# EasyEDA schematic SCH_New-Project_2026-09-16.json
TITLE: Sheet_1; REV: 1.0; Date: 2023-04-25; Sheet: 1/1; Drawn By: tomtheswede; Company: Your Company
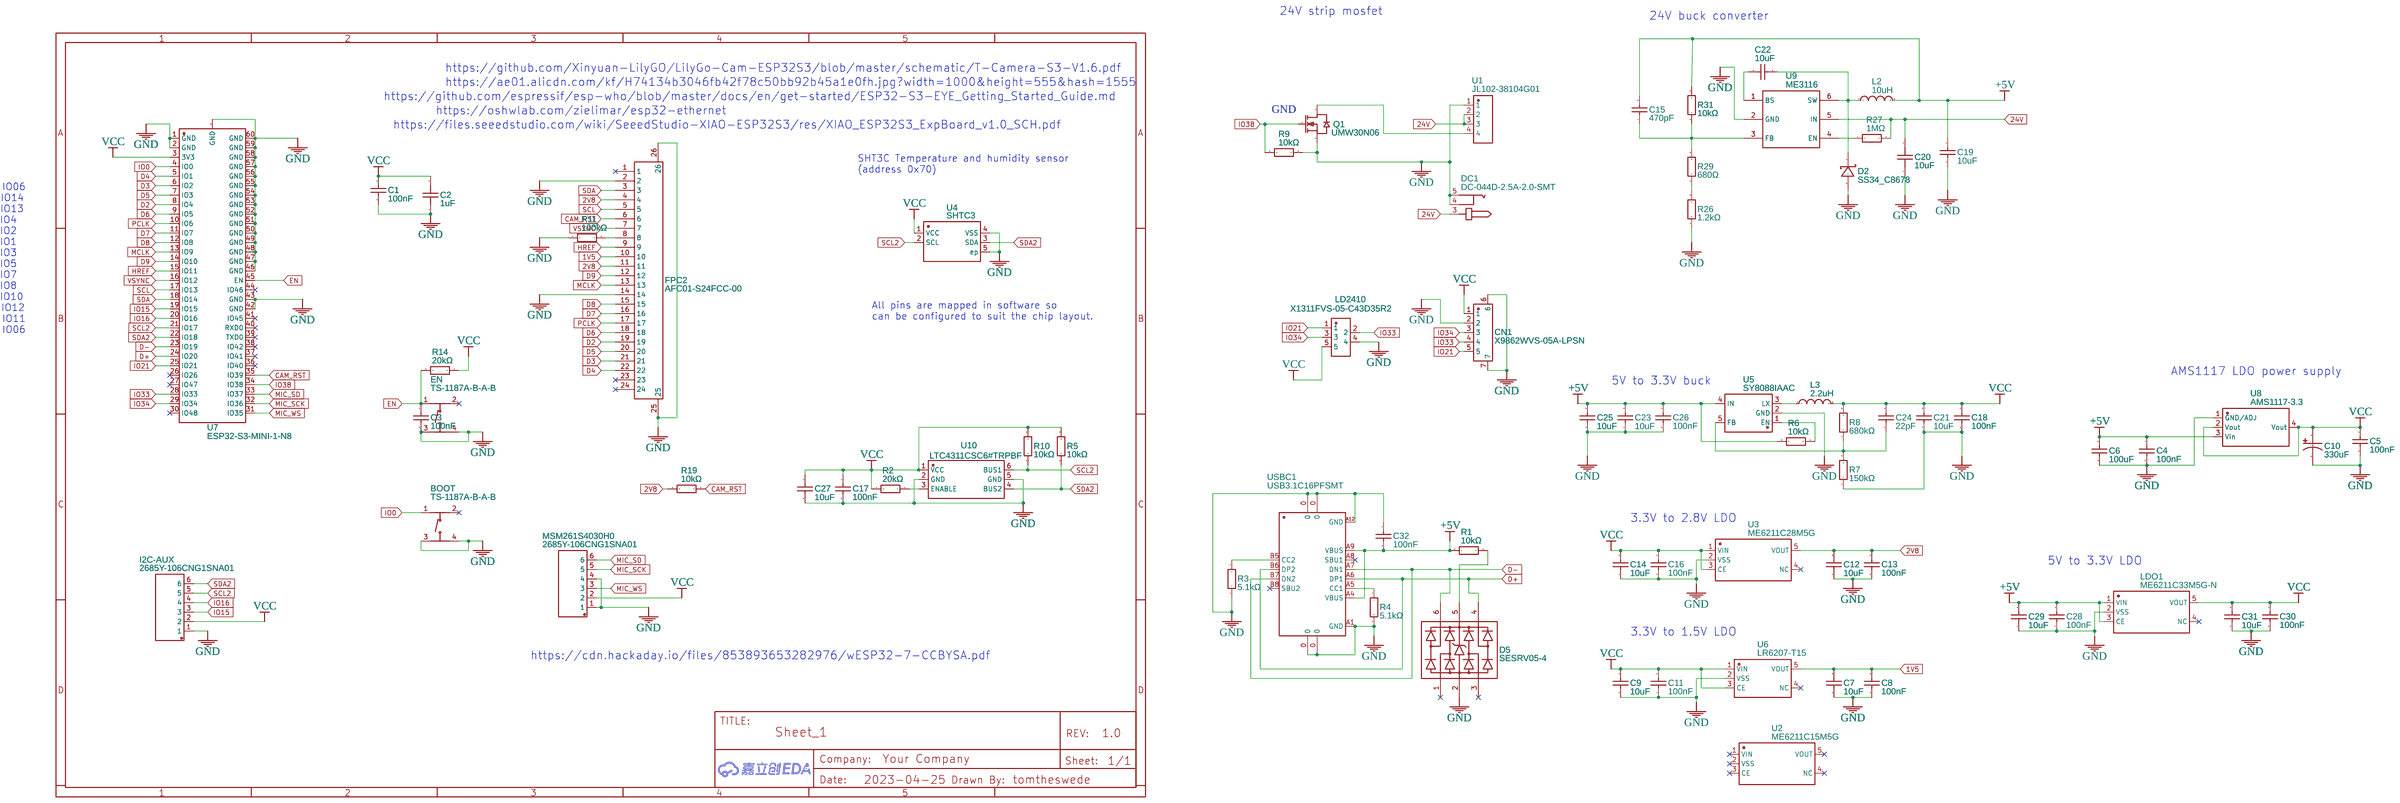
[diagram p0: schematic sheet]

## Parts
BOOT  TS-1187A-B-A-B  [SW-SMD_4P-L5.1-W5.1-P3.70-LS6.5-TL-2]
C1  100nF  [C0402]
C2  1uF  [C0402]
C3  100nF  [C0402]
C4  100nF  [C0402]
C5  100nF  [C0402]
C6  100uF  [C1206]
C7  10uF  [C0402]
C8  100nF  [C0402]
C9  10uF  [C0402]
C10  330uF  [CAP-SMD_L6.0-W3.2-R-RD]
C11  100nF  [C0402]
C12  10uF  [C0402]
C13  100nF  [C0402]
C14  10uF  [C0402]
C15  470pF  [C0402]
C16  100nF  [C0402]
C17  100nF  [C0402]
C18  100nF  [C0402]
C19  10uF  [C0805]
C20  10uF  [C0805]
C21  10uF  [C0402]
C22  10uF  [C0805]
C23  10uF  [C0402]
C24  22pF  [C0402]
C25  10uF  [C0402]
C26  100nF  [C0402]
C27  10uF  [C0402]
C28  100nF  [C0402]
C29  10uF  [C0402]
C30  100nF  [C0402]
C31  10uF  [C0402]
C32  100nF  [C0402]
CN1  X9862WVS-05A-LPSN  [CONN-SMD_X9862WVS-05A-LPSN]
D2  SS34_C8678  [SMA_L4.3-W2.6-LS5.2-RD]
D5  SESRV05-4  [SOT-23-6_L2.9-W1.6-P0.95-LS2.8-BR]
DC1  DC-044D-2.5A-2.0-SMT  [DC-IN-SMD_DC-044D-2.5A-2.0-SMT]
EN  TS-1187A-B-A-B  [SW-SMD_4P-L5.1-W5.1-P3.70-LS6.5-TL-2]
FPC2  AFC01-S24FCC-00  [FPC-SMD_P0.5-24P_FGS-XJ-H2.0]
I2C-AUX  2685Y-106CNG1SNA01  [HDR-TH_6P-P2.54-V-F]
L2  10uH  [IND-SMD_L5.8-W5.2]
L3  2.2uH  [IND-SMD_L4.0-W4.0_FNR40XXS]
LD2410  X1311FVS-05-C43D35R2  [CONN-SMD_5P-P1.27_XKB_X1311FVS-05-C43D35R2]
LDO1  ME6211C33M5G-N  [SOT-23-5_L3.0-W1.7-P0.95-LS2.8-BL]
MSM261S4030H0  2685Y-106CNG1SNA01  [HDR-TH_6P-P2.54-V-F]
Q1  UMW30N06  [TO-252-2_L6.6-W6.1-P4.57-LS9.9-BR-CW]
R1  10kΩ  [R0402]
R2  20kΩ  [R0402]
R3  5.1kΩ  [R0402]
R4  5.1kΩ  [R0402]
R5  10kΩ  [R0402]
R6  10kΩ  [R0402]
R7  150kΩ  [R0402]
R8  680kΩ  [R0603]
R9  10kΩ  [R0402]
R10  10kΩ  [R0402]
R11  100kΩ  [R0402]
R14  20kΩ  [R0402]
R19  10kΩ  [R0402]
R26  1.2kΩ  [R0402]
R27  1MΩ  [R0805]
R29  680Ω  [R0402]
R31  10kΩ  [R0402]
U1  JL102-38104G01  [CONN-TH_4P-P3.81_JILN_JL102-38104G01]
U2  ME6211C15M5G  [SOT-23-5_L3.0-W1.7-P0.95-LS2.8-BR]
U3  ME6211C28M5G  [SOT-23-5_L3.0-W1.7-P0.95-LS2.8-BR]
U4  SHTC3  [SENSORM-SMD_4P-L2.0-W2.0-P1.00]
U5  SY8088IAAC  [SOT-23-5_L3.0-W1.7-P0.95-LS2.8-BL]
U6  LR6207-T15  [SOT-23-5_L2.9-W1.6-P0.95-LS2.8-BL]
U7  ESP32-S3-MINI-1-N8  [BULETM-SMD_ESP32-S3-MINI-1-N8]
U8  AMS1117-3.3  [SOT-223-3_L6.5-W3.4-P2.30-LS7.0-BR]
U9  ME3116  [SOT-23-6_L2.9-W1.6-P0.95-LS2.8-BL]
U10  LTC4311CSC6#TRPBF  [SC-70-6_L2.1-W1.3-P0.65-LS2.1-BR]
USBC1  USB3.1C16PFSMT  [USB-C-SMD_TYPE-C-USB-17]

## Library data of the parts
BOOT EN = TS-1187A-B-A-B: Supplier: LCSC; Supplier Part: C318884; Manufacturer: XKB Enterprise; Contributor: LCSC; JLCPCB Part Class: Basic Part
C1 C3-C5 C8 C11 C13 C16-C18 C26 C28 C30 C32 = CL05B104KO5NNNC: Supplier: LCSC; Manufacturer: SAMSUNG(三星); Supplier Part: C1525; JLCPCB Part Class: Basic Part; link: https://lcsc.com/eda_search?q=C1525&%26type=1&ref=editor
C2 = CL05A105KA5NQNC: Supplier: LCSC; Manufacturer: SAMSUNG(三星); Supplier Part: C52923; JLCPCB Part Class: Basic Part; link: https://lcsc.com/eda_search?q=C52923&%26type=1&ref=editor
C6 = CL31A107MQHNNNE: Supplier: LCSC; Manufacturer: SAMSUNG; Supplier Part: C15008; JLCPCB Part Class: Basic Part
C7 C9 C12 C14 C21 C23 C25 C27 C29 C31 = CL05A106MQ5NUNC: Supplier: LCSC; Manufacturer: SAMSUNG; Supplier Part: C15525; JLCPCB Part Class: Basic Part
C10 = CA45-C6R3K337T: Supplier: LCSC; Supplier Part: C201144; Manufacturer: Hunan Xiangyee in S&T; Contributor: LCSC; JLCPCB Part Class: Extended Part
C15 = 0402B471K500NT: Supplier: LCSC; Manufacturer: FH(风华); Supplier Part: C1537; JLCPCB Part Class: Basic Part
C19 C22 = CL21A106KAYNNNE: Supplier: LCSC; Manufacturer: SAMSUNG(三星); Supplier Part: C15850; JLCPCB Part Class: Basic Part
C20 = GRM21BR61H106KE43L: Supplier: LCSC; Supplier Part: C440198; Manufacturer: muRata(村田); Contributor: LCSC; JLCPCB Part Class: Basic Part
C24 = 0402CG220J500NT: Supplier: LCSC; Manufacturer: FH(风华); Supplier Part: C1555; JLCPCB Part Class: Basic Part
CN1 = X9862WVS-05A-LPSN: Contributor: LCSC; Supplier: LCSC; Supplier Part: C696930; Manufacturer: XKB Connectivity(中国星坤); Manufacturer Part: X9862WVS-05A-6TSN; JLCPCB Part Class: Extended Part; link: https://lcsc.com/eda_search?q=C696930&%26type=1&ref=editor
D2 = SS34_C8678: Supplier: LCSC; Manufacturer Part: SS34; Manufacturer: MDD; Supplier Part: C8678; JLCPCB Part Class: Basic Part
D5 = SESRV05-4: Contributor: LCSC; Supplier: LCSC; Supplier Part: C294963; Manufacturer: SEMIWARE(赛米微尔); JLCPCB Part Class: Extended Part; link: https://lcsc.com/eda_search?q=C294963&%26type=1&ref=editor
DC1 = DC-044D-2.5A-2.0-SMT: Supplier: LCSC; Supplier Part: C397342; Manufacturer: XKB Connectivity(中国星坤); Contributor: LCSC; JLCPCB Part Class: Extended Part
FPC2 = AFC01-S24FCC-00: Supplier: LCSC; Supplier Part: C262276; Manufacturer: JS(钜硕电子); Contributor: LCSC; JLCPCB Part Class: Extended Part
I2C-AUX MSM261S4030H0 = 2685Y-106CNG1SNA01: Supplier: LCSC; Supplier Part: C350307; Manufacturer: 华宇创; Contributor: LCSC; JLCPCB Part Class: Extended Part
L2 = SM5845-100MT: Supplier: LCSC; Manufacturer: SXN(顺翔诺); Supplier Part: C9164; JLCPCB Part Class: Extended Part
L3 = FNR4030S2R2MT: Supplier: LCSC; Manufacturer: cjiang(长江微电); Contributor: LCSC; Supplier Part: C167869; JLCPCB Part Class: Extended Part
LD2410 = X1311FVS-05-C43D35R2: Supplier: LCSC; Supplier Part: C2881514; Manufacturer: XKB Connectivity(中国星坤); Contributor: LCSC; JLCPCB Part Class: Extended Part
LDO1 = ME6211C33M5G-N: Supplier: LCSC; Manufacturer: MICRONE(南京微盟); Supplier Part: C82942; JLCPCB Part Class: Extended Part; link: https://lcsc.com/eda_search?q=C82942&%26type=1&ref=editor
Q1 = UMW30N06: Supplier: LCSC; Supplier Part: C369599; Manufacturer: UMW(广东友台半导体); Manufacturer Part: 30N06; Contributor: LCSC; JLCPCB Part Class: Extended Part
R1 R5 R6 R9 R10 R19 R31 = 0402WGF1002TCE: Supplier: LCSC; Manufacturer: UniOhm; Supplier Part: C25744; Resistance (Ohms): 10K; JLCPCB Part Class: Basic Part
R2 R14 = 0402WGF2002TCE: Supplier: LCSC; Manufacturer: UNI-ROYAL(厚声); Supplier Part: C25765; Resistance (Ohms): 20K; JLCPCB Part Class: Basic Part
R3 R4 = 0402WGF5101TCE: Supplier: LCSC; Manufacturer: UniOhm; Supplier Part: C25905; Resistance (Ohms): 5.1K; JLCPCB Part Class: Basic Part
R7 = 0402WGF1503TCE: Supplier: LCSC; Manufacturer: UNI-ROYAL(厚声); Supplier Part: C25755; Resistance (Ohms): 150K; JLCPCB Part Class: Basic Part
R8 = 0603WAF6803T5E: Supplier: LCSC; Manufacturer: UNI-ROYAL(厚声); Supplier Part: C25822; Resistance (Ohms): 680K; JLCPCB Part Class: Basic Part
R11 = 0402WGF1003TCE: Supplier: LCSC; Manufacturer: UNI-ROYAL(厚声); Supplier Part: C25741; Resistance (Ohms): 100K; JLCPCB Part Class: Basic Part
R26 = 0402WGF1201TCE: Supplier: LCSC; Manufacturer: UNI-ROYAL(厚声); Supplier Part: C25862; Resistance (Ohms): 1.2K; JLCPCB Part Class: Basic Part
R27 = 0805W8F1004T5E: Supplier: LCSC; Manufacturer: UNI-ROYAL(厚声); Supplier Part: C17514; Resistance (Ohms): 1M; JLCPCB Part Class: Basic Part
R29 = 0402WGF6800TCE: Supplier: LCSC; Manufacturer: UNI-ROYAL(厚声); Supplier Part: C25130; Resistance (Ohms): 680; JLCPCB Part Class: Basic Part
U1 = JL102-38104G01: Contributor: LCSC; Supplier: LCSC; Supplier Part: C2917323; Manufacturer: JILN(锦凌); JLCPCB Part Class: Extended Part; link: https://lcsc.com/eda_search?q=C2917323&%26type=1&ref=editor
U2 = ME6211C15M5G: Supplier: LCSC; Manufacturer: MICRONE(南京微盟); Manufacturer Part: ME6211C15M5G-N; Supplier Part: C53100; JLCPCB Part Class: Extended Part
U3 = ME6211C28M5G: Supplier: LCSC; Manufacturer: MICRONE(南京微盟); Manufacturer Part: ME6211C28M5G-N; Supplier Part: C53099; JLCPCB Part Class: Extended Part
U4 = SHTC3: Supplier: LCSC; Supplier Part: C194656; Manufacturer: Sensirion; Contributor: LCSC; JLCPCB Part Class: Extended Part
U5 = SY8088IAAC: Supplier: LCSC; Supplier Part: C479072; Manufacturer: 矽力杰silergy; Contributor: LCSC; JLCPCB Part Class: Extended Part
U6 = LR6207-T15: Contributor: LCSC; Supplier: LCSC; Supplier Part: C459780; Manufacturer: LR(朗瑞); JLCPCB Part Class: Extended Part; link: https://lcsc.com/eda_search?q=C459780&%26type=1&ref=editor
U7 = ESP32-S3-MINI-1-N8: Supplier: LCSC; Supplier Part: C2913206; Manufacturer: ESPRESSIF(乐鑫); link: https://atta.szlcsc.com/upload/public/pdf/source/20220425/7F117D7A09F85946280540FD9EFDF9F3.pdf; JLCPCB Part Class: Extended Part; Contributor: lcsc
U8 = AMS1117-3.3: sourceId: dwIGgezVh; Supplier: LCSC; Manufacturer: AMS; Supplier Part: C6186; JLCPCB Part Class: Basic Part
U9 = ME3116: Supplier: LCSC; Manufacturer: MICRONE(南京微盟); Manufacturer Part: ME3116AM6G; Supplier Part: C97643; JLCPCB Part Class: Extended Part
U10 = LTC4311CSC6#TRPBF: Contributor: LCSC; Supplier: LCSC; Supplier Part: C580856; Manufacturer: ADI(亚德诺); JLCPCB Part Class: Extended Part; link: https://lcsc.com/eda_search?q=C580856&%26type=1&ref=editor
USBC1 = USB3.1C16PFSMT: Supplier: LCSC; Supplier Part: C167321; Manufacturer: LCSC; Contributor: LCSC; JLCPCB Part Class: Extended Part

## Nets
1V5: C7.2 C8.1 FPC2.10 U6.5(VOUT)
2V8: C12.2 C13.1 FPC2.4 FPC2.11 R19.1 U3.5(VOUT)
24V: C20.2 DC1.3 R27.2 U1.2 U1.3 U9.5(IN)
+5V: C4.1 C6.1 C15.2 C19.2 C23.2 C25.2 C26.1 C28.1 C29.2 C32.2 L2.2 LDO1.1(VIN) LDO1.3(CE) R1.2 R6.2 R31.2 U5.4(IN) U8.3(Vin) USBC1.A4(VBUS) USBC1.A9(VBUS)
GND: BOOT.3(C) BOOT.4(D) C1.2 C2.1 C3.2 C4.2 C5.2 C6.2 C7.1 C8.2 C9.1 C10.2 C11.2 C12.1 C13.2 C14.1 C16.2 C17.2 C18.2 C19.1 C20.1 C21.1 C23.1 C25.1 C26.2 C27.1 C28.2 C29.1 C30.2 C31.1 C32.1 CN1.2 CN1.6 CN1.7 D2.2(A) D5.2 DC1.4 DC1.5 EN.3(C) EN.4(D) FPC2.2 FPC2.14 FPC2.25 FPC2.26 I2C-AUX.1 LD2410.4 LDO1.2(VSS) MSM261S4030H0.1 MSM261S4030H0.4 Q1.3(S) R3.1 R4.2 R7.1 R9.2 R11.1 R26.1 U1.1 U3.2(VSS) U4.4(VSS) U4.5(ep) U5.2(GND) U6.2(VSS) U7.1(GND) U7.2(GND) U7.42(GND) U7.43(GND) U7.46(GND) U7.47(GND) U7.48(GND) U7.49(GND) U7.50(GND) U7.51(GND) U7.52(GND) U7.53(GND) U7.54(GND) U7.55(GND) U7.56(GND) U7.57(GND) U7.58(GND) U7.59(GND) U7.60(GND) U7.GND U8.1(GND/ADJ) U9.2(GND) U10.2(GND) U10.5(GND) USBC1.0 USBC1.A1(GND) USBC1.A12(GND)
VCC: C1.1 C2.2 C5.1 C9.2 C10.1 C11.1 C14.2 C16.1 C17.1 C18.1 C21.2 C24.2 C27.2 C30.1 C31.2 CN1.1 I2C-AUX.2 L3.2 LD2410.5 LDO1.5(VOUT) MSM261S4030H0.2 R2.2 R5.2 R8.2 R10.2 R14.1 U3.1(VIN) U3.3(CE) U4.1(VCC) U6.1(VIN) U6.3(CE) U7.3(3V3) U8.2(Vout) U8.4(Vout) U10.1(VCC)
CAM_RST: FPC2.6 R19.2 U7.35(IO39)
D2: FPC2.19 U7.8(IO4)
D3: FPC2.21 U7.6(IO2)
D4: FPC2.22 U7.5(IO1)
D5: FPC2.20 U7.7(IO3)
D6: FPC2.18 U7.9(IO5)
D7: FPC2.16 U7.11(IO7)
D8: FPC2.15 U7.12(IO8)
D9: FPC2.12 U7.14(IO10)
D+: D5.4 U7.24(IO20) USBC1.A6(DP1) USBC1.B6(DP2)
D-: D5.6 U7.23(IO19) USBC1.A7(DN1) USBC1.B7(DN2)
EN: C3.1 EN.1(A) R14.2 U7.45(EN)
HREF: FPC2.9 U7.15(IO11)
IO0: BOOT.1(A) U7.4(IO0)
IO15: I2C-AUX.3 U7.19(IO15)
IO16: I2C-AUX.4 U7.20(IO16)
IO21: CN1.5 LD2410.1 U7.25(IO21)
IO33: CN1.4 LD2410.2 U7.28(IO33)
IO34: CN1.3 LD2410.3 U7.29(IO34)
IO38: Q1.1(G) R9.1 U7.34(IO38)
MCLK: FPC2.13 U7.13(IO9)
MIC_SCK: MSM261S4030H0.5 U7.32(IO36)
MIC_SD: MSM261S4030H0.6 U7.33(IO37)
MIC_WS: MSM261S4030H0.3 U7.31(IO35)
PCLK: FPC2.17 U7.10(IO6)
SCL: FPC2.5 U7.17(IO13)
SCL2: I2C-AUX.5 R10.1 U4.2(SCL) U7.21(IO17) U10.6(BUS1)
SDA: FPC2.3 U7.18(IO14)
SDA2: I2C-AUX.6 R5.1 U4.3(SDA) U7.22(IO18) U10.4(BUS2)
VSYNC: FPC2.7 U7.16(IO12)
Net-(C15-1): C15.1 R29.2 R31.1 U9.3(FB)
Net-(C22-1): C22.1 D2.1(K) L2.1 U9.6(SW)
Net-(C22-2): C22.2 U9.1(BS)
Net-(C24-1): C24.1 R7.2 R8.1 U5.5(FB)
Net-(D5-5): D5.5 R1.1
Net-(FPC2-8): FPC2.8 R11.2
Net-(L3-1): L3.1 U5.3(LX)
Net-(Q1-2): Q1.2(D) U1.4
Net-(R2-1): R2.1 U10.3(ENABLE)
Net-(R3-2): R3.2 USBC1.B5(CC2)
Net-(R4-1): R4.1 USBC1.A5(CC1)
Net-(R6-1): R6.1 U5.1(EN)
Net-(R26-2): R26.2 R29.1
Net-(R27-1): R27.1 U9.4(EN)

Not connected (* = marked no-connect by the designer): BOOT 2(B)*; D5 1* 3*; EN 2(B)*; FPC2 1* 23* 24*; LDO1 4(NC)*; U2 1(VIN)* 2(VSS)* 3(CE)* 4(NC)* 5(VOUT)*; U3 4(NC)*; U6 4(NC)*; U7 26(IO26)* 27(IO47)* 30(IO48)* 36(IO40)* 37(IO41)* 38(IO42)* 39(TXD0)* 40(RXD0)* 41(IO45)* 44(IO46)*; USBC1 A8(SBU1)* B8(SBU2)*

## Notes on the sheet
- 24V strip mosfet
- 24V buck converter
- https://github.com/Xinyuan-LilyGO/LilyGo-Cam-ESP32S3/blob/master/schematic/T-Camera-S3-V1.6.pdf
- https://ae01.alicdn.com/kf/H74134b3046fb42f78c50bb92b45a1e0fh.jpg?width=1000&height=555&hash=1555
- https://github.com/espressif/esp-who/blob/master/docs/en/get-started/ESP32-S3-EYE_Getting_Started_Guide.md
- https://oshwlab.com/zielimar/esp32-ethernet
- GND
- https://files.seeedstudio.com/wiki/SeeedStudio-XIAO-ESP32S3/res/XIAO_ESP32S3_ExpBoard_v1.0_SCH.pdf
- SHT3C Temperature and humidity sensor
  (address 0x70)
- PCLK IO06
  SDA  IO14
  SCL  IO13
  D2   IO4
  D3   IO2
  D4   IO1
  D5   IO3
  D6   IO5
  D7   IO7
  D8   IO8
  D9   IO10
  VSYC IO12
  HREF IO11
  PCLK IO06
- All pins are mapped in software so
  can be configured to suit the chip layout.
- AMS1117 LDO power supply
- 5V to 3.3V buck
- 3.3V to 2.8V LDO
- 5V to 3.3V LDO
- 3.3V to 1.5V LDO
- https://cdn.hackaday.io/files/853893653282976/wESP32-7-CCBYSA.pdf
